# Altium schematic sheet RS485.SchDoc
size A4; SheetNumber: 10; SheetTotal: 11
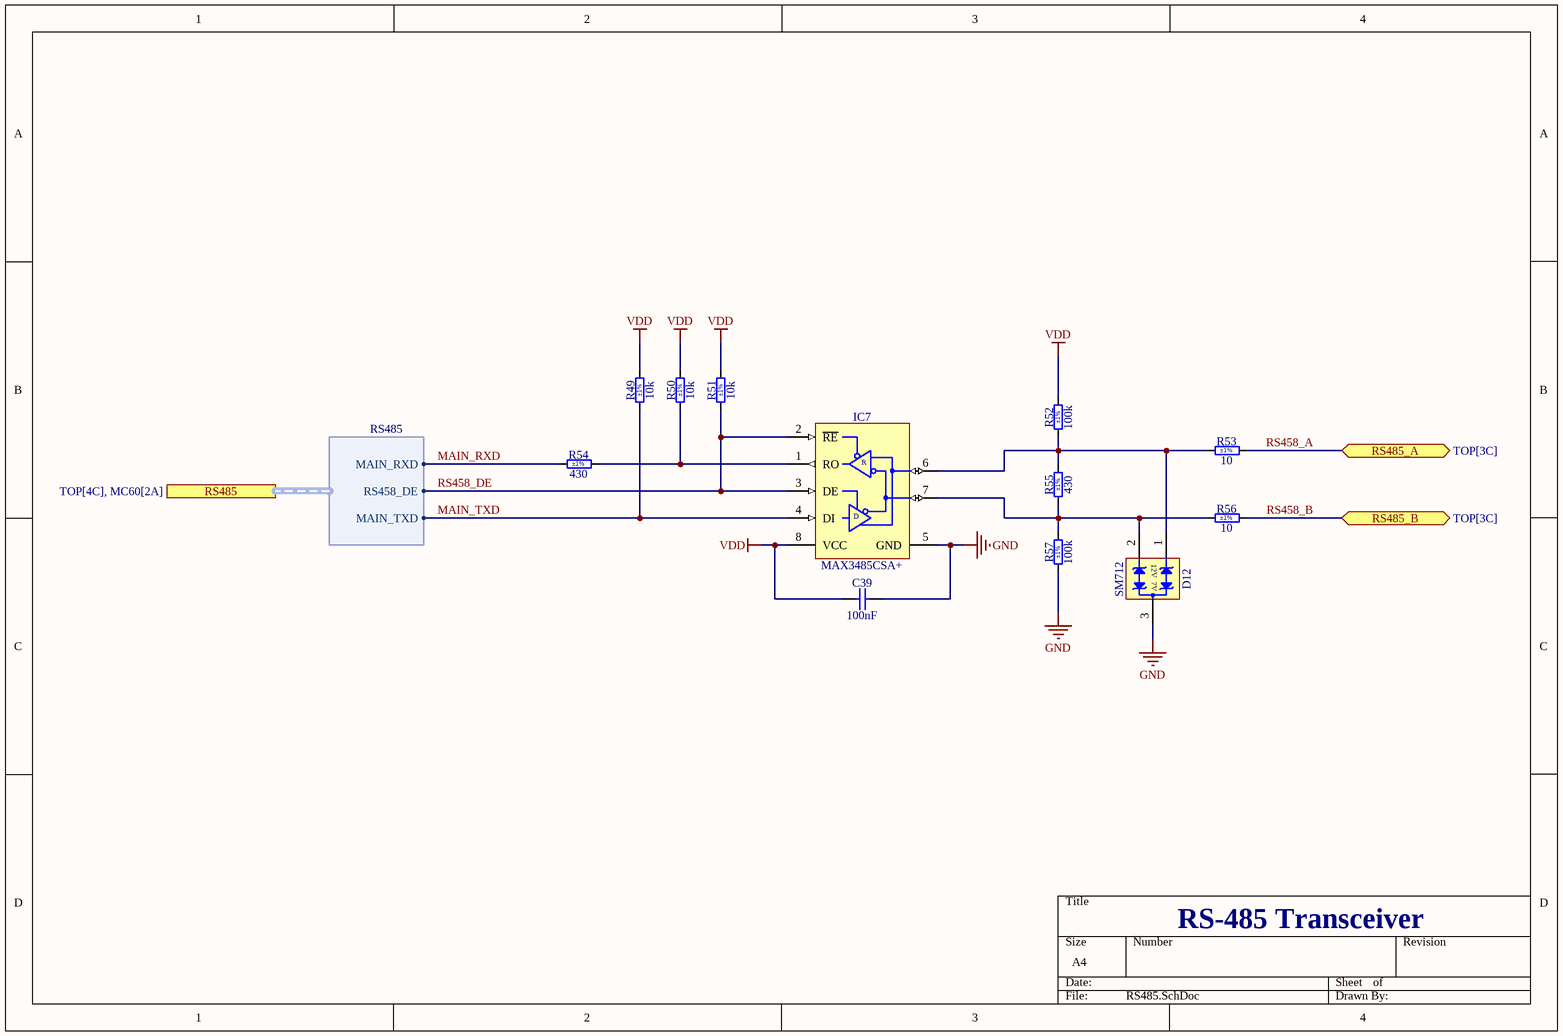
[diagram p0: RS485.SchDoc]

## Parts
C39  100nF  [CAPC1608X87N]
D12  SM712  [SOT95P237X112-3N]
IC7  MAX3485CSA+  [SOIC127P600X175-8N]
R49  10k  Tolerance: ±1%  [RESC1608X55N]
R50  10k  Tolerance: ±1%  [RESC1608X55N]
R51  10k  Tolerance: ±1%  [RESC1608X55N]
R52  100k  Tolerance: ±1%  [RESC1608X55N]
R53  10  Tolerance: ±1%  [RESC1608X55N]
R54  430  Tolerance: ±1%  [RESC1608X55N]
R55  430  Tolerance: ±1%  [RESC1608X55N]
R56  10  Tolerance: ±1%  [RESC1608X55N]
R57  100k  Tolerance: ±1%  [RESC1608X55N]

## Ports
RS485 (harness RS485, see TOP[4C], MC60[2A]), RS485_A (bidir, see TOP[3C]), RS485_B (bidir, see TOP[3C])

## Harnesses
RS485: MAIN_RXD, RS458_DE, MAIN_TXD

## Nets
GND: C39.2 D12.3(GND) IC7.5(GND) R57.1
VDD: C39.1 IC7.8(VCC) R49.2 R50.2 R51.2 R52.2
MAIN_RXD: R54.1 ; port RS485.MAIN_RXD
MAIN_TXD: IC7.4(DI) R49.1 ; port RS485.MAIN_TXD
RS458_A: R53.2 ; port RS485_A
RS458_B: R56.2 ; port RS485_B
RS458_DE: IC7.2(~{RE}) IC7.3(DE) R51.1 ; port RS485.RS458_DE
NetD12_1: D12.1(I/O1) IC7.6(A) R52.1 R53.1 R55.2
NetD12_2: D12.2(I/O2) IC7.7(B) R55.1 R56.1 R57.2
NetIC7_1: IC7.1(RO) R50.1 R54.2

## Notes on the sheet
- RS-485 Transceiver
- (in symbol MAX3485CSA+) R; D
- (in symbol SM712) 12V; 7V

## Library data of the parts
C39 = CC0603_100NF_50V_10%_X7R: Non-polarised capacitor; Part Description: SMD Multilayer Chip Ceramic Capacitor; Manufacturer: GENERIC; Manufacturer1 Part Number: 223858615649; Voltage: 50V; TC: X7R; Tolerance: ±10%; Part Number: CC0603_100NF_50V_10%_X7R; Component Kind: Standard; Component Type: Standard; Pin Count: 2; Value: 100nF; Status: Preferred; Manufacturer Part Number: CC0603_100NF_50V_10%_X7R; Case: 0603; Mounted: Yes; Socket: No; SMD: Yes; Sense: No; Manufacturer1 Example: PHYCOMP; Manufacturer1 ComponentHeight: 0.87mm; HelpURL: \\cern.ch\dfs\Applications\Altium\Datasheets\CC0603_X7R_PHYCOMP.pdf; Author: CERN DEM JLC; CreateDate: 03.12.2007; LatestRevisionDate: 03.12.2007
D12 = SM712: Asymmetrical TVS Diode for Extended Common-Mode RS-485; Manufacturer: SEMTECH; Voltage: 12V/-7V; Power: 400W; PressFit: No; Bonding: No; Part Number: SM712; Component Kind: Standard; Component Type: Standard; Device: SM712; PackageDescription: SOT, 0.95mm Pitch; 3 Pin, 1.30mm W X 2.92mm L X 1.12mm H body, IPC Medium Density; Status: Obsolete; Part Description: Asymmetrical TVS Diode for Extended Common-Mode RS-485; Manufacturer Part Number: SM712; Pin Count: 3; Case: SOT23-3; Mounted: Yes; Socket: No; SMD: Yes; Sense: No; ComponentHeight: 1.12mm; HelpURL: \\cern.ch\dfs\Applications\Altium\Datasheets\SM712.pdf; Author: CERN DEM JLC; CreateDate: 23.04.2012; LatestRevisionDate: 23.04.2012
IC7 = MAX3485CSA+: 3.3V-Powered, ±15kV ESD-Protected, 10Mbps,True RS-485/RS-422 Half Duplex Transceiver; Manufacturer: MAXIM; PressFit: No; Bonding: No; Part Number: MAX3485CSA+; Component Kind: Standard; Component Type: Standard; Device: MAX3485CSA+; PackageDescription: SOIC, 1.27mm Pitch; 8 Pin - Body 4x5mm, IPC Medium Density; Part Description: 3.3V-Powered, ±15kV ESD-Protected, 10Mbps,True RS-485/RS-422 Half Duplex Transceiver; Manufacturer Part Number: MAX3485CSA+; Pin Count: 8; Case: SOIC8; Mounted: Yes; Socket: No; SMD: Yes; Sense: No; ComponentHeight: 1.75mm; HelpURL: \\cern.ch\dfs\Applications\Altium\Datasheets\MAX3485CSA+.pdf; Author: CERN DEM JLC; CreateDate: 05.10.2009; LatestRevisionDate: 05.10.2009
R49-R51 = R0603_10K_1%_0.1W_100PPM: Resistor - 1%; Part Description: General Purpose Thick Film Chip Resistor; Manufacturer: GENERIC; Manufacturer1 Part Number: NRC06F1002TRF; Power: 0.1W; TC: ±100ppm/°C; PressFit: No; Part Number: R0603_10K_1%_0.1W_100PPM; Component Kind: Standard; Component Type: Standard; Pin Count: 2; Value: 10k; Status: Preferred; Manufacturer Part Number: R0603_10K_1%_0.1W_100PPM; Case: 0603; Mounted: Yes; Sense: No; Socket: No; SMD: Yes; Manufacturer1 Example: NIC COMPONENT; Manufacturer1 ComponentHeight: 0.55mm; HelpURL: \\cern.ch\dfs\Applications\Altium\Datasheets\R0603_NIC_NRC.pdf; Author: CERN DEM JLC; CreateDate: 03.12.2007; LatestRevisionDate: 13.03.2008
R52 R57 = R0603_100K_1%_0.1W_100PPM: Resistor - 1%; Part Description: General Purpose Thick Film Chip Resistor; Manufacturer: GENERIC; Manufacturer1 Part Number: NRC06F1003TRF; Power: 0.1W; TC: ±100ppm/°C; PressFit: No; Part Number: R0603_100K_1%_0.1W_100PPM; Component Kind: Standard; Component Type: Standard; Pin Count: 2; Value: 100k; Status: Preferred; Manufacturer Part Number: R0603_100K_1%_0.1W_100PPM; Case: 0603; Mounted: Yes; Sense: No; Socket: No; SMD: Yes; Manufacturer1 Example: NIC COMPONENT; Manufacturer1 ComponentHeight: 0.55mm; HelpURL: \\cern.ch\dfs\Applications\Altium\Datasheets\R0603_NIC_NRC.pdf; Author: CERN DEM JLC; CreateDate: 03.12.2007; LatestRevisionDate: 13.03.2008
R53 R56 = R0603_10R_1%_0.1W_200PPM: Resistor - 1%; Part Description: General Purpose Thick Film Chip Resistor; Manufacturer: GENERIC; Manufacturer1 Part Number: NRC06F10R0TRF; Power: 0.1W; TC: ±200ppm/°C; PressFit: No; Part Number: R0603_10R_1%_0.1W_200PPM; Component Kind: Standard; Component Type: Standard; Pin Count: 2; Value: 10; Status: Preferred; Manufacturer Part Number: R0603_10R_1%_0.1W_200PPM; Case: 0603; Mounted: Yes; Sense: No; Socket: No; SMD: Yes; Manufacturer1 Example: NIC COMPONENT; Manufacturer1 ComponentHeight: 0.55mm; HelpURL: \\cern.ch\dfs\Applications\Altium\Datasheets\R0603_NIC_NRC.pdf; Author: CERN DEM JLC; CreateDate: 03.12.2007; LatestRevisionDate: 24.06.2009
R54 R55 = R0603_430R_1%_0.1W_100PPM: Resistor - 1%; Part Description: General Purpose Thick Film Chip Resistor; Manufacturer: GENERIC; Manufacturer1 Part Number: NRC06F4300TRF; Power: 0.1W; TC: ±100ppm/°C; PressFit: No; Part Number: R0603_430R_1%_0.1W_100PPM; Component Kind: Standard; Component Type: Standard; Pin Count: 2; Value: 430; Status: Preferred; Manufacturer Part Number: R0603_430R_1%_0.1W_100PPM; Case: 0603; Mounted: Yes; Sense: No; Socket: No; SMD: Yes; Manufacturer1 Example: NIC COMPONENT; Manufacturer1 ComponentHeight: 0.55mm; HelpURL: \\cern.ch\dfs\Applications\Altium\Datasheets\R0603_NIC_NRC.pdf; Author: CERN DEM JLC; CreateDate: 03.12.2007; LatestRevisionDate: 13.03.2008